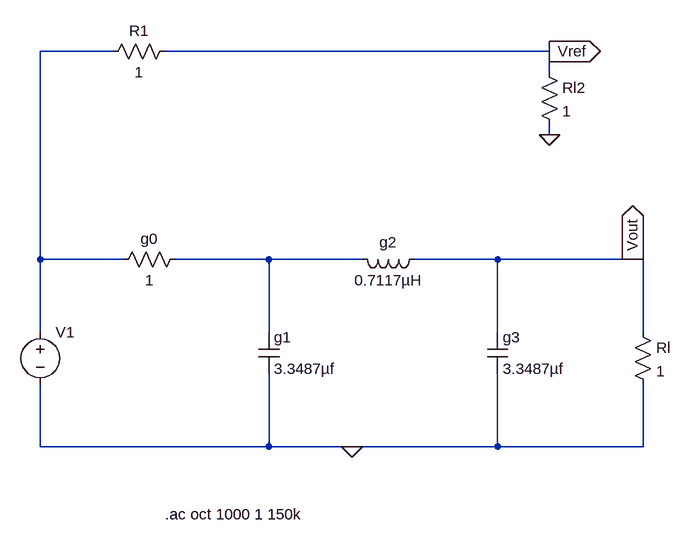
[diagram p0: schematic LC Filter.asc]
LC Filter.asc, the LTspice schematic file:
Version 4
SHEET 1 1256 680
WIRE 384 -96 272 -96
WIRE 1056 -96 464 -96
WIRE 1056 -64 1056 -96
WIRE 1056 32 1056 16
WIRE 272 224 272 -96
WIRE 400 224 272 224
WIRE 624 224 480 224
WIRE 768 224 624 224
WIRE 976 224 848 224
WIRE 1184 224 976 224
WIRE 1200 224 1184 224
WIRE 272 336 272 224
WIRE 624 336 624 224
WIRE 976 336 976 224
WIRE 1200 336 1200 224
WIRE 272 512 272 416
WIRE 624 512 624 400
WIRE 624 512 272 512
WIRE 752 512 624 512
WIRE 976 512 976 400
WIRE 976 512 752 512
WIRE 1200 512 1200 416
WIRE 1200 512 976 512
FLAG 752 512 0
FLAG 1184 224 Vout
IOPIN 1184 224 Out
FLAG 1056 32 0
FLAG 1056 -96 Vref
IOPIN 1056 -96 Out
SYMBOL Voltage 272 320 R0
SYMATTR InstName V1
SYMATTR Value ""
SYMATTR Value2 AC 1
SYMBOL Cap 608 336 R0
SYMATTR InstName g1
SYMATTR Value 3.3487µf
SYMBOL Cap 960 336 R0
SYMATTR InstName g3
SYMATTR Value 3.3487µf
SYMBOL Ind 864 208 R90
WINDOW 0 5 56 VBottom 2
WINDOW 3 32 56 VTop 2
SYMATTR InstName g2
SYMATTR Value 0.7117µH
SYMBOL Res 496 208 R90
WINDOW 0 0 56 VBottom 2
WINDOW 3 32 56 VTop 2
SYMATTR InstName g0
SYMATTR Value 1
SYMBOL Res 1184 320 R0
SYMATTR InstName Rl
SYMATTR Value 1
SYMBOL Res 1040 -80 R0
SYMATTR InstName Rl2
SYMATTR Value 1
SYMBOL Res 480 -112 R90
WINDOW 0 0 56 VBottom 2
WINDOW 3 32 56 VTop 2
SYMATTR InstName R1
SYMATTR Value 1
TEXT 464 616 Left 2 !.ac oct 1000 1 150k

The netlist it stands for:
* LC Filter.asc
V1 N001 0 AC 1
C§g1 N002 0 3.3487µf
C§g3 Vout 0 3.3487µf
L§g2 Vout N002 0.7117µH
R§g0 N002 N001 1
Rl Vout 0 1
Rl2 Vref 0 1
R1 Vref N001 1
.ac oct 1000 1 150k
.backanno
.end